# EAGLE schematic FridgeWarninig_0.5 (EAGLE 7.3.0)
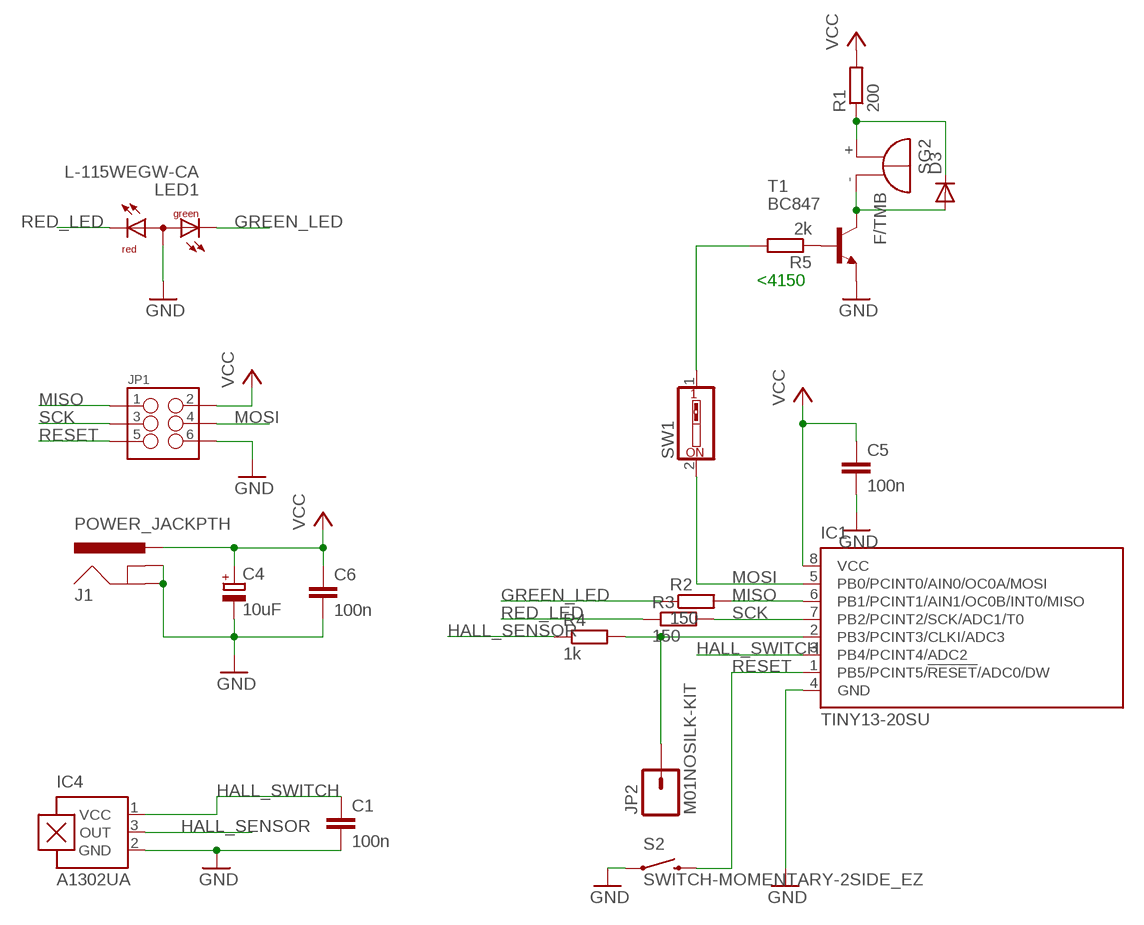
[diagram p0: schematic, sheet 1]

## Parts
C1  100n  C-EUC0603  [C0603]
C4  10uF  CPOL-EUE2-5  [E2-5]
C5  100n  C-EUC0603  [C0603]
C6  100n  C-EUC0603  [C0603]
D3  DIODE-DO-214AC  [DO-214AC]
IC1  TINY13-20SU  [8S2]
IC4  A1302UA  [SIP3-UA]
J1  POWER_JACKPTH  [POWER_JACK_PTH]
JP1  M03X2SHROUD  [2X3-SHROUDED]
JP2  M01NOSILK-KIT  [1X01NS-KIT]
LED1  L-115WEGW-CA  [DUOLED-A-3MM]
R1  200  R-EU_R0603  [R0603]
R2  150  R-EU_R0603  [R0603]
R3  150  R-EU_R0603  [R0603]
R4  1k  R-EU_R0603  [R0603]
R5  2k  R-EU_R0603  [R0603]
S2  SWITCH-MOMENTARY-2SIDE_EZ  [TACTILE-PTH-SIDEEZ]
SG2  F/TMB  [F/TMB]
SW1  SW_DIP-1  [EDG-01]
T1  BC847  [SOT23]

## Nets
GND: C1.2 C4.- C5.2 C6.2 IC1.4(GND) IC4.2(GND) J1.GND J1.GNDBREAK JP1.6 LED1.2(A) S2.1 T1.2(E)
GREEN_LED: LED1.1(CG) R2.1
HALL_SENSOR: IC4.3(OUT) R4.1
HALL_SWITCH: C1.1 IC1.3(PB4/PCINT4/ADC2) IC4.1(VCC)
MISO: IC1.6(PB1/PCINT1/AIN1/OC0B/INT0/MISO) JP1.1 R2.2
MOSI: IC1.5(PB0/PCINT0/AIN0/OC0A/MOSI) JP1.4 SW1.2
N$2: R5.2 SW1.1
N$4: D3.2(A) SG2.- T1.3(C)
N$5: IC1.2(PB3/PCINT3/CLKI/ADC3) JP2.1 R4.2
N$6: D3.1(C) R1.1 SG2.+
N$7: R5.1 T1.1(B)
RED_LED: LED1.3(CR) R3.1
RESET: IC1.1(PB5/PCINT5/!RESET!/ADC0/DW) JP1.5 S2.2
SCK: IC1.7(PB2/PCINT2/SCK/ADC1/T0) JP1.3 R3.2
VCC: C4.+ C5.1 C6.1 IC1.8(VCC) J1.PWR JP1.2 R1.2

## Notes on the sheet
- <4150

## Library data of the parts
C1 C5 C6 = resistor:C-EU: CAPACITOR, European symbol
C4 = rcl:CPOL-EU: POLARIZED CAPACITOR, European symbol
D3 = dp_devices:DIODE: Various Diode Packages
IC1 = atmel:TINY13: 8-bit AVR Microcontroller with 1K Bytes In-System Programmable Flash Source: http://www.atmel.com/dyn/resources/prod_documents/2535S.pdf; MPN: ATTINY13-20SU; OC_FARNELL: 9171568; OC_NEWARK: 96K6522
IC4 = dea:A13*?: Linear Hall Effect Sensor ICs Continuous-Time Ratiometric High-Temperature Operation Programmable Linear with Analog Output A1302 -Replacement- UGN3503 Source: http://www.allegromicro.com/en/Products/Part_Numbers/1301/1301.pdf http://www.allegromicro.com/en/Products/Part_Numbers/1321/1321.pdf http://www.allegromicro.com/en/Products/Part_Numbers/1381/1381.pdf; MF: ALLEGRO MICROSYSTEMS, INC.; MPN: A1302EUA-T; OC_FARNELL: 1521708; OC_NEWARK: 31K6639
J1 = SparkFun-Connectors:POWER_JACK: Power Jack This is the standard 5.5mm barrel jack for power. The PTH is the most common, proven, reliable, footprint. The Slot footprint only works if the mill layer is transmitted to the PCB fab house so be warned. Mating wall wart : TOL-00298 (and others); PROD_ID: PRT-00119
JP1 = SparkFun-Connectors:M03X2: 2x3 .1" header. Shrouded, with keying- CONN-10681 SMT- CONN-11415 Pogo pins- HW-11044; PROD_ID: CONN-10681
JP2 = SparkFun-Connectors:M01: Header 1 Standard 1-pin 0.1" header. Use with straight break away headers (SKU : PRT-00116), right angle break away headers (PRT-00553), swiss pins (PRT-00743), machine pins (PRT-00117), and female headers (PRT-00115).
LED1 = led:L-115WEGW-CA: T-1(3mm) BI-COLOR INDICATOR LAMP Source: Kingbright .. 2_colour_led_.pdf
R1-R5 = resistor:R-EU_: RESISTOR, European symbol
S2 = dea:SWITCH-MOMENTARY-2: Various NO switches- pushbuttons, reed, etc
SG2 = dea:F/TMB: BUZZER Source: Buerklin; OC_FARNELL: unknown; OC_NEWARK: unknown
SW1 = special:SW_DIP-1: DIP SWITCH
T1 = transistor:BC847: NPN TRANSISTOR